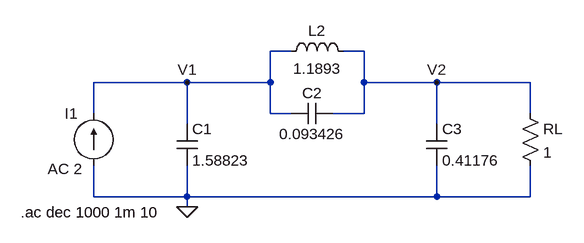
[diagram p0: schematic ej2.asc]
ej2.asc, the LTspice schematic file:
Version 4
SHEET 1 880 680
WIRE 272 16 240 16
WIRE 384 16 352 16
WIRE 112 64 -32 64
WIRE 240 64 240 16
WIRE 240 64 112 64
WIRE 384 64 384 16
WIRE 496 64 384 64
WIRE 640 64 496 64
WIRE -32 112 -32 64
WIRE 240 112 240 64
WIRE 272 112 240 112
WIRE 384 112 384 64
WIRE 384 112 336 112
WIRE 640 112 640 64
WIRE 112 128 112 64
WIRE 496 128 496 64
WIRE -32 240 -32 192
WIRE 112 240 112 192
WIRE 112 240 -32 240
WIRE 496 240 496 192
WIRE 496 240 112 240
WIRE 640 240 640 192
WIRE 640 240 496 240
WIRE 112 256 112 240
FLAG 112 256 0
FLAG 112 64 V1
FLAG 496 64 V2
SYMBOL ind 256 32 R270
WINDOW 0 32 56 VTop 2
WINDOW 3 5 56 VBottom 2
SYMATTR InstName L2
SYMATTR Value 1.1893
SYMATTR SpiceLine Rser=0
SYMBOL cap 336 96 R90
WINDOW 0 0 32 VBottom 2
WINDOW 3 32 32 VTop 2
SYMATTR InstName C2
SYMATTR Value 0.093426
SYMBOL cap 96 128 R0
SYMATTR InstName C1
SYMATTR Value 1.58823
SYMBOL cap 480 128 R0
SYMATTR InstName C3
SYMATTR Value 0.41176
SYMBOL current -32 192 R180
WINDOW 0 24 80 Left 2
WINDOW 3 24 0 Left 2
WINDOW 123 17 -5 Left 2
WINDOW 39 0 0 Left 0
SYMATTR InstName I1
SYMATTR Value ""
SYMATTR Value2 AC 2
SYMBOL res 624 96 R0
SYMATTR InstName RL
SYMATTR Value 1
TEXT -144 264 Left 2 !.ac dec 1000 1m 10

The netlist it stands for:
* ej2.asc
L2 V1 V2 1.1893 Rser=0
C2 V2 V1 0.093426
C1 V1 0 1.58823
C3 V2 0 0.41176
I1 0 V1 AC 2
RL V2 0 1
.ac dec 1000 1m 10
.backanno
.end

* Results of the author's LTspice run, read from the files saved beside the schematic
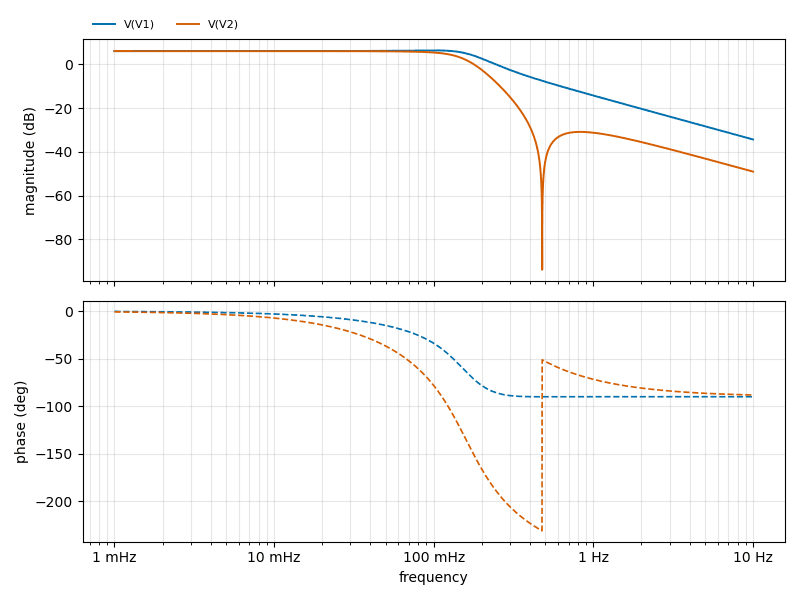
[diagram p1: AC Analysis of ej2.asc, plotted from the saved traces]
* AC Analysis, 1 run:
*   V(V1): 6.02 dB at 1 mHz, -34.37 dB at 10 Hz, peak 6.33 dB at 99.77 mHz, 3 dB below the peak at 188.1 mHz
*   V(V2): 6.02 dB at 1 mHz, -49.05 dB at 10 Hz, peak 6.02 dB at 1 mHz, 3 dB below the peak at 147.6 mHz